# Altium schematic sheet NTC.SchDoc
size 420 x 297 mm; SheetNumber: 7; SheetTotal: 11
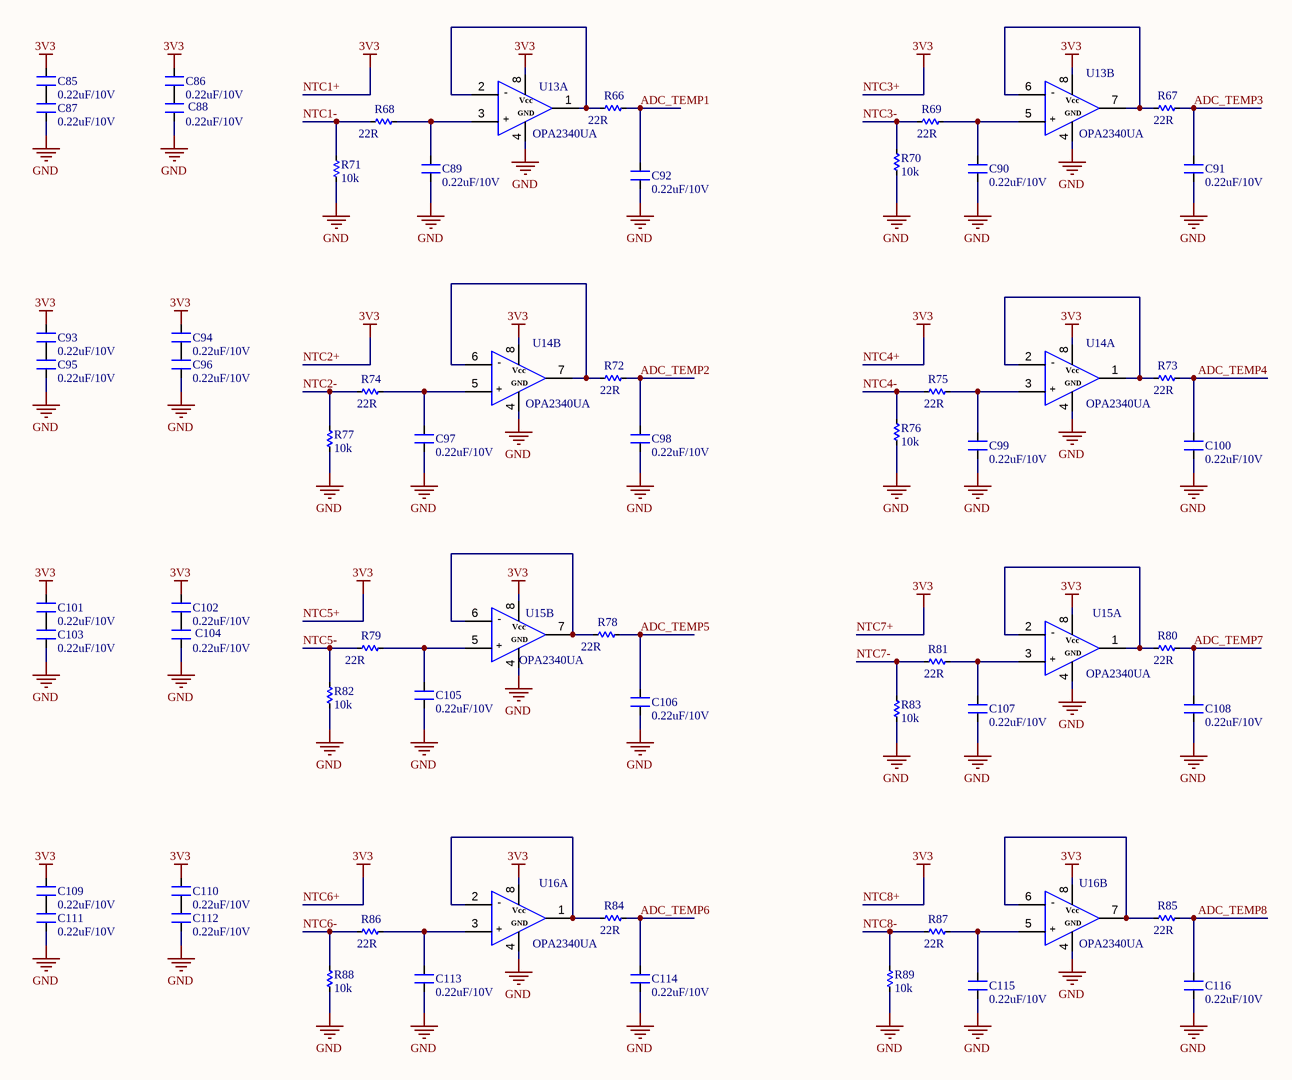
[diagram p0: NTC.SchDoc]

## Parts
C85  0.22uF/10V  [CAP_C_1608X80]
C86  0.22uF/10V  [CAP_C_1608X80]
C87  0.22uF/10V  [CAP_C_1608X80]
C88  0.22uF/10V  [CAP_C_1608X80]
C89  0.22uF/10V  [CAP_C_1608X80]
C90  0.22uF/10V  [CAP_C_1608X80]
C91  0.22uF/10V  [CAP_C_1608X80]
C92  0.22uF/10V  [CAP_C_1608X80]
C93  0.22uF/10V  [CAP_C_1608X80]
C94  0.22uF/10V  [CAP_C_1608X80]
C95  0.22uF/10V  [CAP_C_1608X80]
C96  0.22uF/10V  [CAP_C_1608X80]
C97  0.22uF/10V  [CAP_C_1608X80]
C98  0.22uF/10V  [CAP_C_1608X80]
C99  0.22uF/10V  [CAP_C_1608X80]
C100  0.22uF/10V  [CAP_C_1608X80]
C101  0.22uF/10V  [CAP_C_1608X80]
C102  0.22uF/10V  [CAP_C_1608X80]
C103  0.22uF/10V  [CAP_C_1608X80]
C104  0.22uF/10V  [CAP_C_1608X80]
C105  0.22uF/10V  [CAP_C_1608X80]
C106  0.22uF/10V  [CAP_C_1608X80]
C107  0.22uF/10V  [CAP_C_1608X80]
C108  0.22uF/10V  [CAP_C_1608X80]
C109  0.22uF/10V  [CAP_C_1608X80]
C110  0.22uF/10V  [CAP_C_1608X80]
C111  0.22uF/10V  [CAP_C_1608X80]
C112  0.22uF/10V  [CAP_C_1608X80]
C113  0.22uF/10V  [CAP_C_1608X80]
C114  0.22uF/10V  [CAP_C_1608X80]
C115  0.22uF/10V  [CAP_C_1608X80]
C116  0.22uF/10V  [CAP_C_1608X80]
R66  22R  [RES_C_1608X60]
R67  22R  [RES_C_1608X60]
R68  22R  [RES_C_1608X60]
R69  22R  [RES_C_1608X60]
R70  10k  [RES_C_1608X60]
R71  10k  [RES_C_1608X60]
R72  22R  [RES_C_1608X60]
R73  22R  [RES_C_1608X60]
R74  22R  [RES_C_1608X60]
R75  22R  [RES_C_1608X60]
R76  10k  [RES_C_1608X60]
R77  10k  [RES_C_1608X60]
R78  22R  [RES_C_1608X60]
R79  22R  [RES_C_1608X60]
R80  22R  [RES_C_1608X60]
R81  22R  [RES_C_1608X60]
R82  10k  [RES_C_1608X60]
R83  10k  [RES_C_1608X60]
R84  22R  [RES_C_1608X60]
R85  22R  [RES_C_1608X60]
R86  22R  [RES_C_1608X60]
R87  22R  [RES_C_1608X60]
R88  10k  [RES_C_1608X60]
R89  10k  [RES_C_1608X60]
U13  OPA2340UA  [SO8]  (parts A,B of 2)
U14  OPA2340UA  [SO8]  (parts A,B of 2)
U15  OPA2340UA  [SO8]  (parts A,B of 2)
U16  OPA2340UA  [SO8]  (parts A,B of 2)

## Nets
GND: C87.1 C88.1 C89.1 C90.1 C91.1 C92.1 C95.1 C96.1 C97.1 C98.1 C99.1 C100.1 C103.1 C104.1 C105.1 C106.1 C107.1 C108.1 C111.1 C112.1 C113.1 C114.1 C115.1 C116.1 R70.2 R71.2 R76.2 R77.2 R82.2 R83.2 R88.2 R89.2 U13.4 U14.4 U15.4 U16.4
NTC1+: C85.2 C86.2 C93.2 C94.2 C101.2 C102.2 C109.2 C110.2 U13.8 U14.8 U15.8 U16.8  [also labelled 3V3, NTC2+, NTC3+, NTC4+, NTC5+, NTC6+, NTC7+, NTC8+]
ADC_TEMP1: C92.2 R66.2
ADC_TEMP2: C98.2 R72.2
ADC_TEMP3: C91.2 R67.2
ADC_TEMP4: C100.2 R73.2
ADC_TEMP5: C106.2 R78.2
ADC_TEMP6: C114.2 R84.2
ADC_TEMP7: C108.2 R80.2
ADC_TEMP8: C116.2 R85.2
NTC1-: R68.1 R71.1
NTC2-: R74.1 R77.1
NTC3-: R69.1 R70.1
NTC4-: R75.1 R76.1
NTC5-: R79.1 R82.1
NTC6-: R86.1 R88.1
NTC7-: R81.1 R83.1
NTC8-: R87.1 R89.1
NetC85_1: C85.1 C87.2
NetC86_1: C86.1 C88.2
NetC89_2: C89.2 R68.2 U13.3
NetC90_2: C90.2 R69.2 U13.5
NetC93_1: C93.1 C95.2
NetC94_1: C94.1 C96.2
NetC97_2: C97.2 R74.2 U14.5
NetC99_2: C99.2 R75.2 U14.3
NetC101_1: C101.1 C103.2
NetC102_1: C102.1 C104.2
NetC105_2: C105.2 R79.2 U15.5
NetC107_2: C107.2 R81.2 U15.3
NetC109_1: C109.1 C111.2
NetC110_1: C110.1 C112.2
NetC113_2: C113.2 R86.2 U16.3
NetC115_2: C115.2 R87.2 U16.5
NetR66_1: R66.1 U13.1 U13.2
NetR67_1: R67.1 U13.6 U13.7
NetR72_1: R72.1 U14.6 U14.7
NetR73_1: R73.1 U14.1 U14.2
NetR78_1: R78.1 U15.6 U15.7
NetR80_1: R80.1 U15.1 U15.2
NetR84_1: R84.1 U16.1 U16.2
NetR85_1: R85.1 U16.6 U16.7

## Notes on the sheet
- Project:
- BEE-PC1
- Sub-system:
- NANORACK_EXP_CONTROLLER
- Design by:
- SANG HUYNH
- BAO BUI Q.
- Sheet title:
- Sheet
- A3
- of
- Checked by:
- Approved by:
- VU PHAM
- Revision:
- Document No:
- V1.1.1
- Size:
- Date:
- (in symbol OPA2340UA, part A) -; Vcc; GND; +
- (in symbol OPA2340UA, part B) -; Vcc; GND; +

## Library data of the parts
C85-C116 = Capacitors: Value: 33pF
R66-R89 = Res SMD: SMD; Manufacturer: Generic Components; Class: Passive; Published: 08/06/2000; Publisher: Altium Hobart Technology Centre